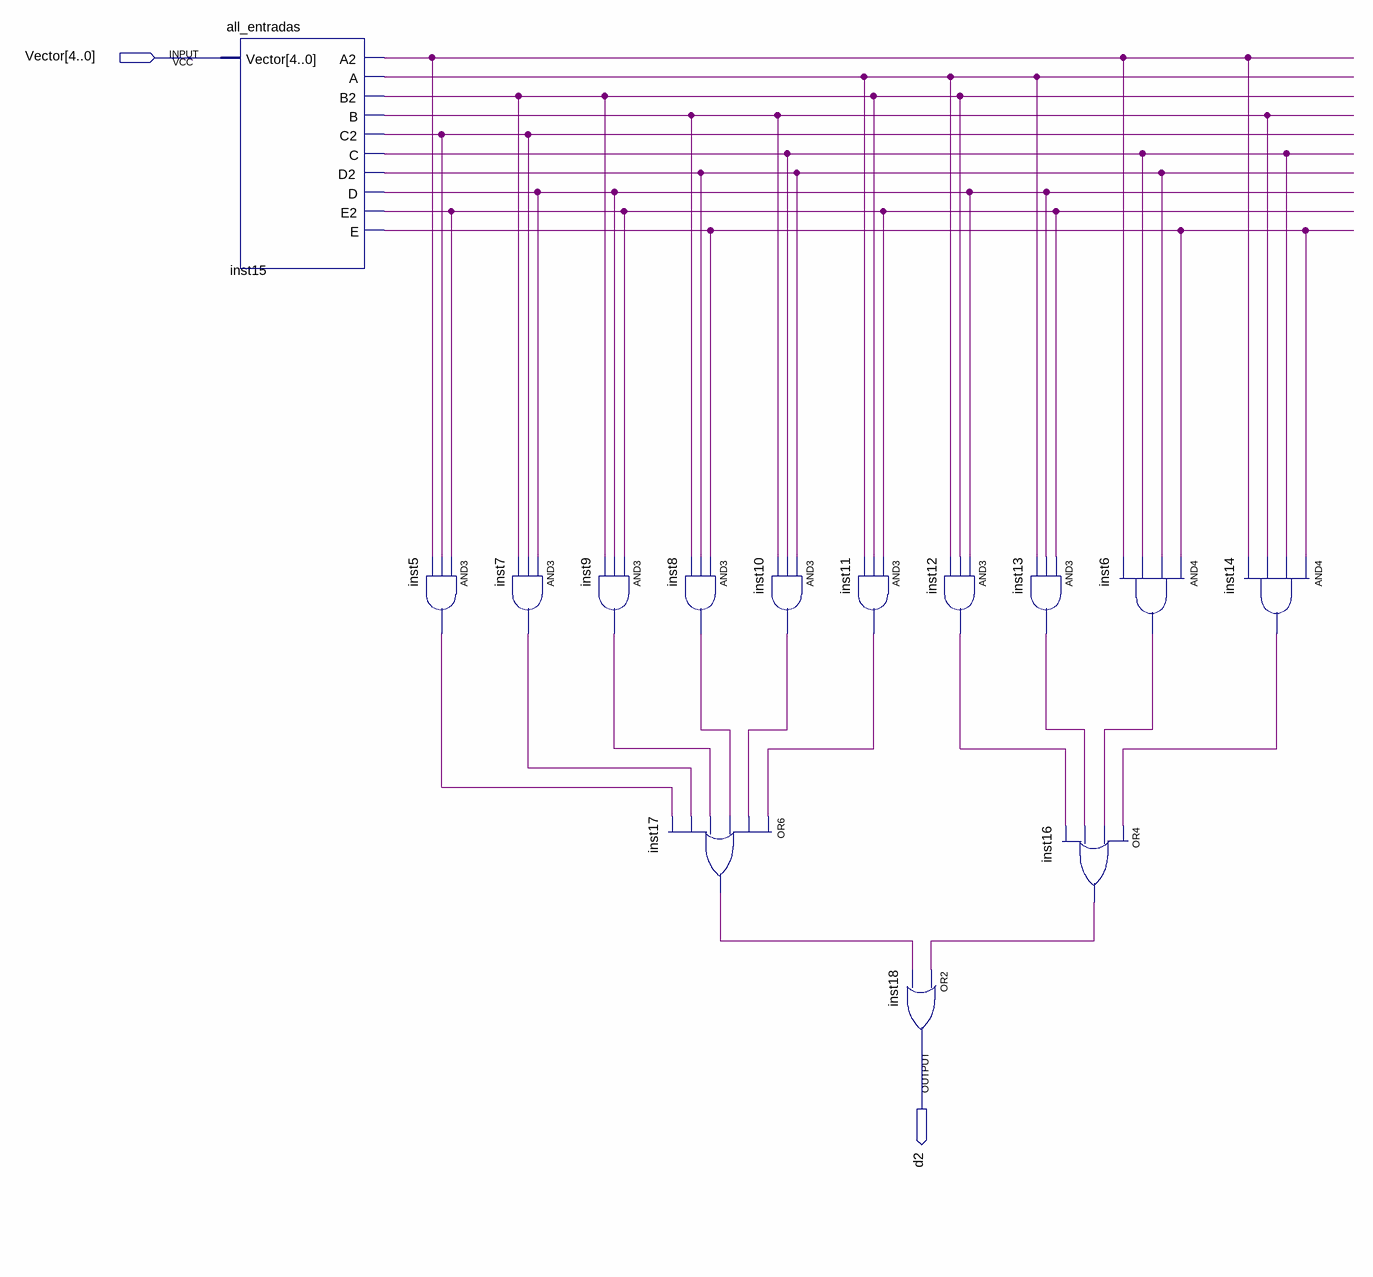
[diagram p0: schematic sheet]
// Quartus schematic d2.bdf as structural Verilog: 14 symbols, 2 pins
module d2 (
  input  [4:0] Vector,
  output d2
);

  wire inst5_out, inst6_out, inst7_out, inst8_out, inst9_out, inst10_out, inst11_out, inst12_out, inst13_out,
       inst14_out, inst15_a, inst15_a2, inst15_b, inst15_b2, inst15_c, inst15_c2, inst15_d, inst15_d2,
       inst15_e, inst15_e2, inst16_out, inst17_out;

  all_entradas inst15 (
    .Vector(Vector), .A2(inst15_a2), .A(inst15_a), .B2(inst15_b2), .B(inst15_b), .C2(inst15_c2),
    .C(inst15_c), .D2(inst15_d2), .D(inst15_d), .E2(inst15_e2), .E(inst15_e));
  and inst5 (inst5_out, inst15_e2, inst15_c2, inst15_a2);
  and inst7 (inst7_out, inst15_d, inst15_c2, inst15_b2);
  and inst9 (inst9_out, inst15_e2, inst15_d, inst15_b2);
  and inst8 (inst8_out, inst15_e, inst15_d2, inst15_b);
  or inst17 (inst17_out, inst11_out, inst10_out, inst8_out, inst9_out, inst7_out, inst5_out);
  and inst10 (inst10_out, inst15_d2, inst15_c, inst15_b);
  and inst11 (inst11_out, inst15_e2, inst15_b2, inst15_a);
  or inst18 (d2, inst16_out, inst17_out);
  and inst12 (inst12_out, inst15_d, inst15_b2, inst15_a);
  and inst13 (inst13_out, inst15_e2, inst15_d, inst15_a);
  or inst16 (inst16_out, inst14_out, inst6_out, inst13_out, inst12_out);
  and inst6 (inst6_out, inst15_e, inst15_d2, inst15_c, inst15_a2);
  and inst14 (inst14_out, inst15_e, inst15_c, inst15_b, inst15_a2);
endmodule
